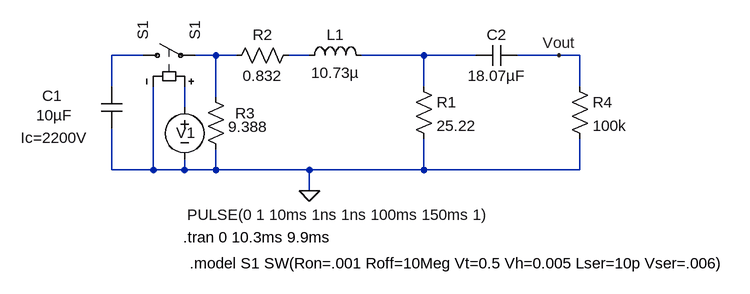
[diagram p0: schematic CWG-Open.asc]
CWG-Open.asc, the LTspice schematic file:
Version 4
SHEET 1 1008 680
WIRE 32 112 -16 112
WIRE 144 112 112 112
WIRE 176 112 144 112
WIRE 288 112 256 112
WIRE 464 112 368 112
WIRE 544 112 464 112
WIRE 672 112 608 112
WIRE 704 112 672 112
WIRE -16 160 -16 112
WIRE 464 160 464 112
WIRE 704 160 704 112
WIRE 144 176 144 112
WIRE 96 192 96 160
WIRE -16 288 -16 224
WIRE 48 288 48 160
WIRE 48 288 -16 288
WIRE 96 288 96 272
WIRE 96 288 48 288
WIRE 144 288 144 256
WIRE 144 288 96 288
WIRE 288 288 144 288
WIRE 464 288 464 240
WIRE 464 288 288 288
WIRE 704 288 704 240
WIRE 704 288 464 288
WIRE 288 320 288 288
FLAG 288 320 0
FLAG 672 112 Vout
SYMBOL cap -32 160 R0
WINDOW 0 -91 14 Left 2
WINDOW 3 -100 44 Left 2
WINDOW 39 -124 79 Left 2
SYMATTR InstName C1
SYMATTR Value 10µF
SYMATTR SpiceLine Ic=2200V
SYMBOL ind 272 128 R270
WINDOW 0 32 56 VTop 2
WINDOW 3 5 56 VBottom 2
SYMATTR InstName L1
SYMATTR Value 10.73µ
SYMBOL res 448 144 R0
SYMATTR InstName R1
SYMATTR Value 25.22
SYMBOL cap 608 96 R90
WINDOW 0 0 32 VBottom 2
WINDOW 3 32 32 VTop 2
SYMATTR InstName C2
SYMATTR Value 18.07µF
SYMBOL sw 16 112 R270
SYMATTR InstName S1
SYMATTR Value S1
SYMBOL res 272 96 R90
WINDOW 0 0 56 VBottom 2
WINDOW 3 32 56 VTop 2
SYMATTR InstName R2
SYMATTR Value 0.832
SYMBOL res 160 272 R180
WINDOW 0 -45 71 Left 2
WINDOW 3 -64 50 Left 2
SYMATTR InstName R3
SYMATTR Value 9.388
SYMBOL voltage 96 176 R0
WINDOW 0 -13 55 Left 2
WINDOW 3 4 181 Left 2
WINDOW 123 0 0 Left 0
WINDOW 39 0 0 Left 0
SYMATTR InstName V1
SYMATTR Value PULSE(0 1 10ms 1ns 1ns 100ms 150ms 1)
SYMBOL res 688 144 R0
SYMATTR InstName R4
SYMATTR Value 100k
TEXT 94 392 Left 2 !.tran 0 10.3ms 9.9ms
TEXT 104 432 Left 2 !.model S1 SW(Ron=.001 Roff=10Meg Vt=0.5 Vh=0.005 Lser=10p Vser=.006)

The netlist it stands for:
* CWG-Open.asc
C1 N001 0 10µF Ic=2200V
L1 N003 N004 10.73µ
R1 N004 0 25.22
C2 Vout N004 18.07µF
S1 N001 N002 N005 0 S1
R2 N003 N002 0.832
R3 0 N002 9.388
V1 N005 0 PULSE(0 1 10ms 1ns 1ns 100ms 150ms 1)
R4 Vout 0 100k
.tran 0 10.3ms 9.9ms
.model S1 SW(Ron=.001 Roff=10Meg Vt=0.5 Vh=0.005 Lser=10p Vser=.006)
.backanno
.end